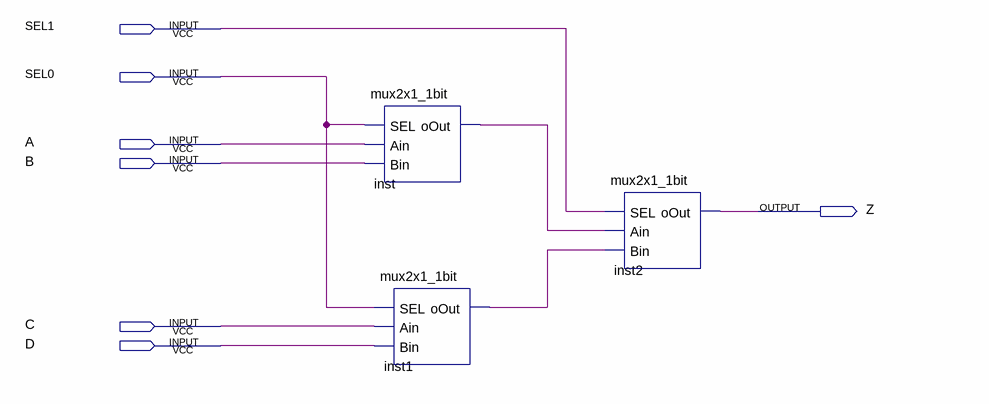
[diagram p0: schematic sheet]
// Quartus schematic mux4x1_1bit.bdf as structural Verilog: 3 symbols, 7 pins
module mux4x1_1bit (
  input  SEL1,
  input  SEL0,
  input  A,
  input  B,
  input  C,
  input  D,
  output Z
);

  wire inst1_oout, inst_oout;

  mux2x1_1bit inst (.SEL(SEL0), .Bin(B), .Ain(A), .oOut(inst_oout));
  mux2x1_1bit inst1 (.SEL(SEL0), .Bin(D), .Ain(C), .oOut(inst1_oout));
  mux2x1_1bit inst2 (.SEL(SEL1), .Bin(inst1_oout), .Ain(inst_oout), .oOut(Z));
endmodule
